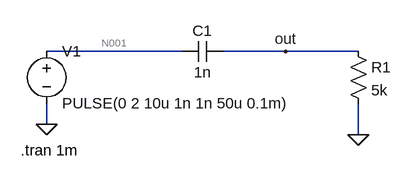
[diagram p0: schematic quiz_q15.asc]
quiz_q15.asc, the LTspice schematic file:
Version 4
SHEET 1 880 680
WIRE 336 80 128 80
WIRE 496 80 400 80
WIRE 608 80 496 80
WIRE 128 192 128 160
WIRE 608 208 608 160
FLAG 128 192 0
FLAG 608 208 0
FLAG 496 80 out
SYMBOL cap 400 64 R90
WINDOW 0 0 32 VBottom 2
WINDOW 3 32 32 VTop 2
SYMATTR InstName C1
SYMATTR Value 1n
SYMBOL voltage 128 64 R0
WINDOW 123 0 0 Left 0
WINDOW 39 0 0 Left 0
SYMATTR InstName V1
SYMATTR Value PULSE(0 2 10u 1n 1n 50u 0.1m)
SYMBOL res 592 64 R0
SYMATTR InstName R1
SYMATTR Value 5k
TEXT 88 232 Left 2 !.tran 1m

The netlist it stands for:
* quiz_q15.asc
C1 out N001 1n
V1 N001 0 PULSE(0 2 10u 1n 1n 50u 0.1m)
R1 out 0 5k
.tran 1m
.backanno
.end

* Results of the author's LTspice run, read from the files saved beside the schematic
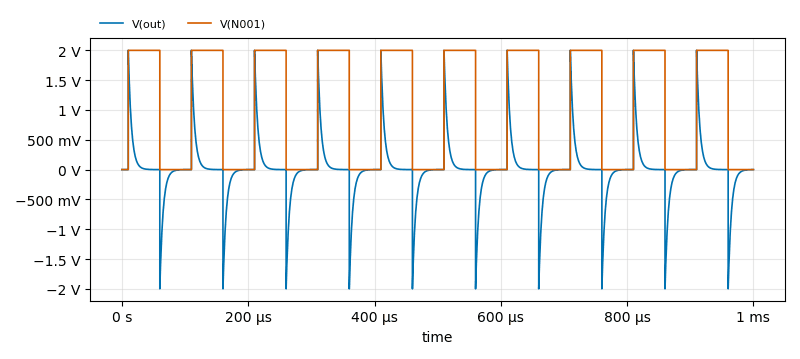
[diagram p1: Transient Analysis of quiz_q15.asc, plotted from the saved traces]
* Transient Analysis, 1 run:
*   V(out): min -2 V, max 2 V, average 22.23 µV, rms 453 mV, last -654.7 µV
*   V(N001): min 0 V, max 2 V, average 1 V, rms 1.414 V, last 0 V